# Altium schematic sheet [02] Block Diagram.SchDoc
size B; DocumentNumber: 2; SheetNumber: 2; SheetTotal: 8
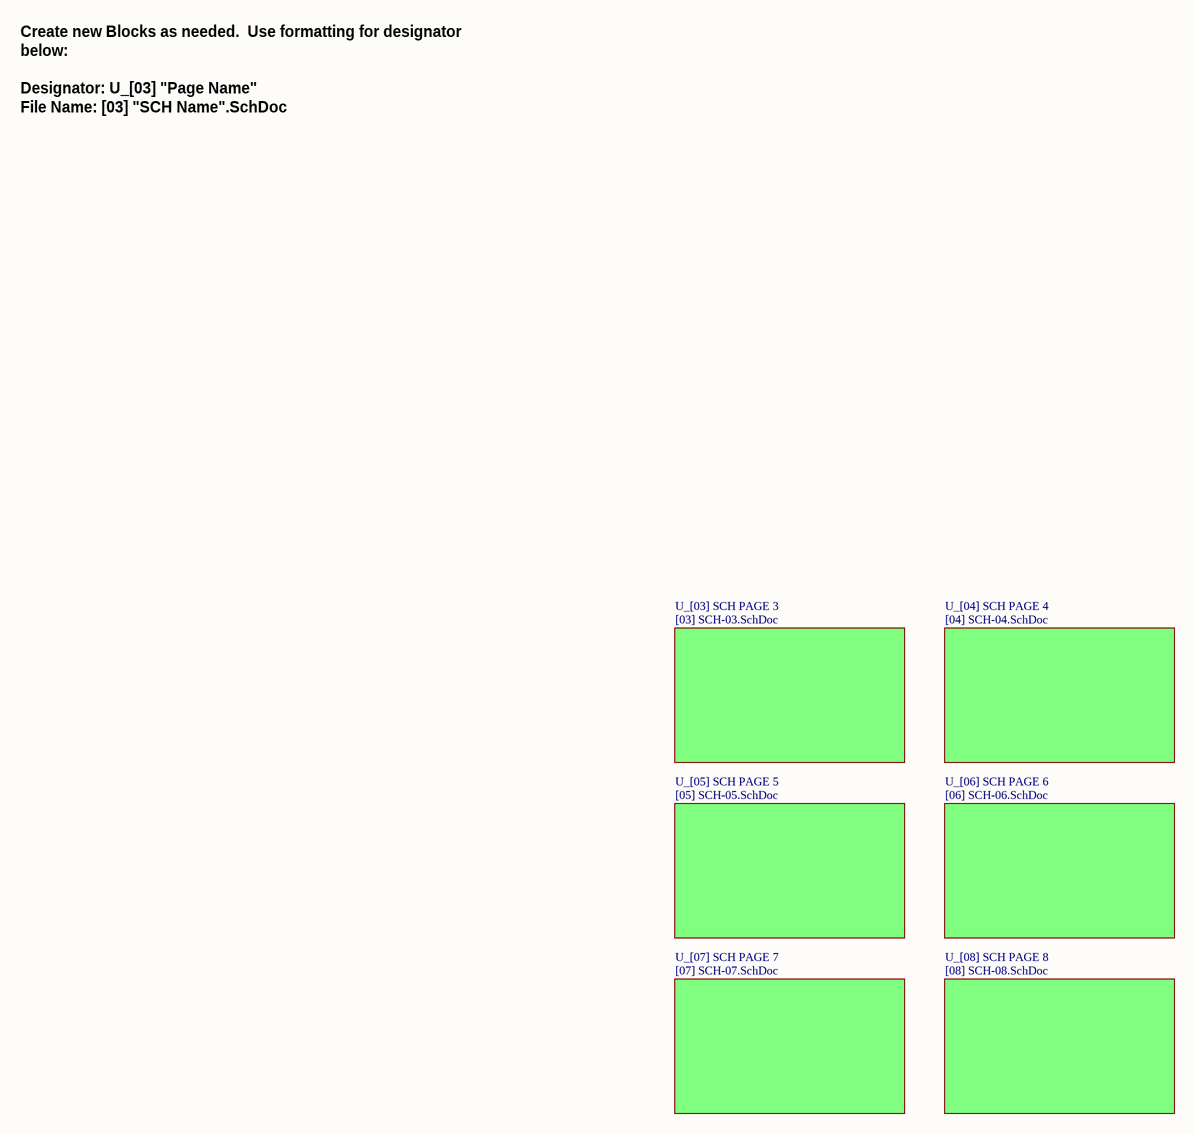
[diagram p0: [02] Block Diagram.SchDoc]

## Sub-sheets
U_[03] SCH PAGE 3 = [03] SCH-03.SchDoc: no entries
U_[04] SCH PAGE 4 = [04] SCH-04.SchDoc: no entries
U_[05] SCH PAGE 5 = [05] SCH-05.SchDoc: no entries
U_[06] SCH PAGE 6 = [06] SCH-06.SchDoc: no entries
U_[07] SCH PAGE 7 = [07] SCH-07.SchDoc: no entries
U_[08] SCH PAGE 8 = [08] SCH-08.SchDoc: no entries

## Notes on the sheet
- Create new Blocks as needed.  Use formatting for designator below:
  Designator: U_[03] "Page Name"
  File Name: [03] "SCH Name".SchDoc
- CONFIDENTIAL INFORMATION
- Size:
- Date:
- B
- Part #:
- Time:
- Rev:
- Sheet
- of
- File: